# Altium schematic sheet LOGIC.SchDoc
size Letter; SheetNumber: 3; SheetTotal: 3
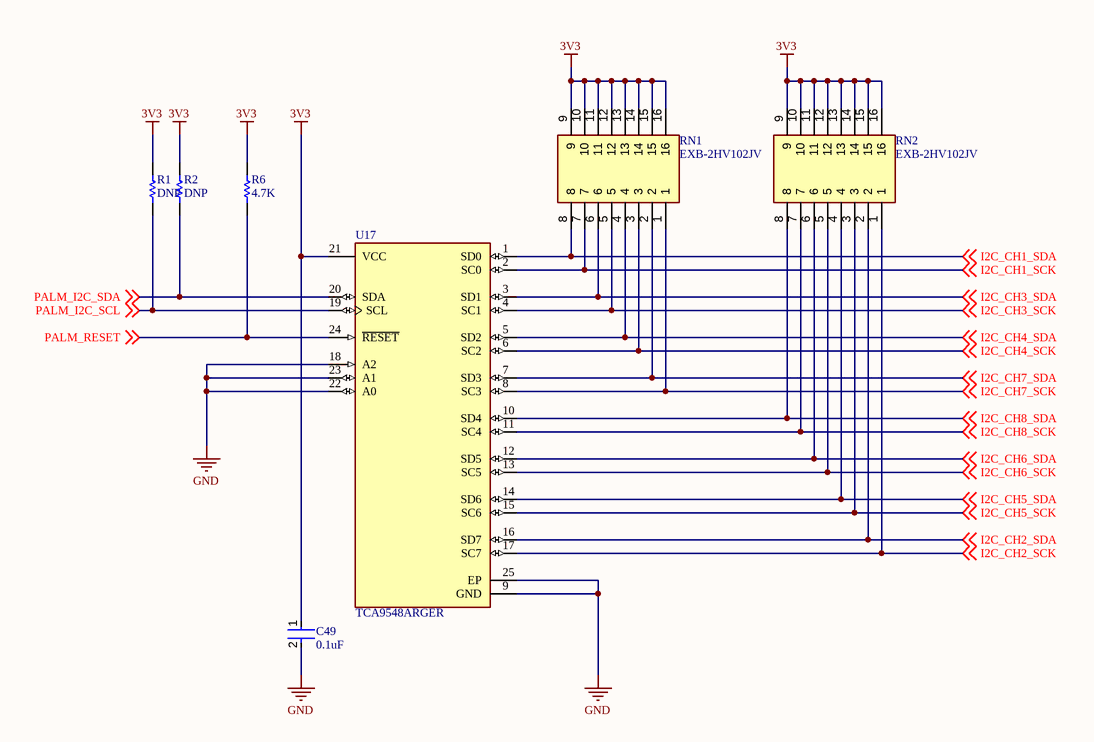
[diagram p0: LOGIC.SchDoc]

## Parts
C49  0.1uF  [FP-GRM15-MFG]
R1  DNP  [RESC1005X40X25LL05T10]
R2  DNP  [RESC1005X40X25LL05T10]
R6  4.7K  [RESC1005X40X25LL05T05]
RN1  EXB-2HV102JV  [EXB2HV102JV]
RN2  EXB-2HV102JV  [EXB2HV102JV]
U17  TCA9548ARGER  [FP-RGE0024C-MFG]

## Nets
3V3: C49.1 R1.2 R2.2 R6.2 RN1.9 RN1.10 RN1.11 RN1.12 RN1.13 RN1.14 RN1.15 RN1.16 RN2.9 RN2.10 RN2.11 RN2.12 RN2.13 RN2.14 RN2.15 RN2.16 U17.21(VCC)
GND: C49.2 U17.9(GND) U17.18(A2) U17.22(A0) U17.23(A1) U17.25(EP)
I2C_CH1_SCK: RN1.7 U17.2(SC0) ; off-sheet I2C_CH1_SCK
I2C_CH1_SDA: RN1.8 U17.1(SD0) ; off-sheet I2C_CH1_SDA
I2C_CH2_SCK: RN2.1 U17.17(SC7) ; off-sheet I2C_CH2_SCK
I2C_CH2_SDA: RN2.2 U17.16(SD7) ; off-sheet I2C_CH2_SDA
I2C_CH3_SCK: RN1.5 U17.4(SC1) ; off-sheet I2C_CH3_SCK
I2C_CH3_SDA: RN1.6 U17.3(SD1) ; off-sheet I2C_CH3_SDA
I2C_CH4_SCK: RN1.3 U17.6(SC2) ; off-sheet I2C_CH4_SCK
I2C_CH4_SDA: RN1.4 U17.5(SD2) ; off-sheet I2C_CH4_SDA
I2C_CH5_SCK: RN2.3 U17.15(SC6) ; off-sheet I2C_CH5_SCK
I2C_CH5_SDA: RN2.4 U17.14(SD6) ; off-sheet I2C_CH5_SDA
I2C_CH6_SCK: RN2.5 U17.13(SC5) ; off-sheet I2C_CH6_SCK
I2C_CH6_SDA: RN2.6 U17.12(SD5) ; off-sheet I2C_CH6_SDA
I2C_CH7_SCK: RN1.1 U17.8(SC3) ; off-sheet I2C_CH7_SCK
I2C_CH7_SDA: RN1.2 U17.7(SD3) ; off-sheet I2C_CH7_SDA
I2C_CH8_SCK: RN2.7 U17.11(SC4) ; off-sheet I2C_CH8_SCK
I2C_CH8_SDA: RN2.8 U17.10(SD4) ; off-sheet I2C_CH8_SDA
PALM_I2C_SCL: R1.1 U17.19(SCL) ; off-sheet PALM_I2C_SCL
PALM_I2C_SDA: R2.1 U17.20(SDA) ; off-sheet PALM_I2C_SDA
PALM_RESET: R6.1 U17.24(~{RESET}) ; off-sheet PALM_RESET

## Notes on the sheet
- Title
- Copyright (c) Meta Platforms, Inc. and affiliates.
  All rights reserved.
  This source code is licensed under the license found in the
  LICENSE file in the root directory of this source tree.
- Sheet
- of

## Library data of the parts
C49 = CMP-2100-03641-2: CAP CER 0.1UF 16V X7R 0402; Manufacturer Part Number: GRM155R71C104KA88D; Manufacturer: Murata; Standoff Height: 0mm; Tolerance: 10%; Voltage Rating: 16Vdc; Material: Ceramic; Capacitance: 0.10μF; Value: 0.10μF; RoHS: TRUE; Temperature Characteristic: X7R; Octopart: https://octopart.com/grm155r71c104ka88d-murata-196880; Digikey Description: CAP CER 0.1UF 16V X7R 0402; Device Class L3: Ceramic Capacitors; Height: 0.55mm; ComponentLink2Description: Datasheet; Temperature Range Low: -55°C; Ipc Land Pattern Name: CAPC10050X219; ComponentLink2URL: https://search.murata.co.jp/Ceramy/image/img/A01X/G101/ENG/GRM155R71H471KA01-01A.pdf; Device Class L1: Passive Components; Lead Free: yes; Category: Cap; Package: GRM15; Temperature: -55°C to +125°C; Device Class L2: Capacitors; Temperature Range High: +125°C; Mouser Description: 0402 0.1 uF 16V ±10 % Tolerance X7R SMT Multilayer Ceramic Capacitor
R1 R2 = CMP-2002-07941-1: Part Number: RC0402JR-071KL; Manufacturer: Yageo / Phycomp
R6 = CMP-2002-01154-4: Chip Resistor, 4.7 KOhm, +/- 1%, 0.1 W, -55 to 155 degC, 0402 (1005 Metric), RoHS, Tape and Reel; PartNumber: ERJ-2RKF4701X; Voltage Rating: 50 V; Case\/Package: 0402; Power Rating: 100 mW; Height: 0.35 mm; Mounting Technology: Surface Mount; REACH SVHC: Yes; Resistance: 4.7 KOhm; Max Operating Temperature: 155 degC; ComponentLink1Description: Manufacturer URL; ComponentLink2Description: Datasheet; Pins: 2; PackageReference: 0402; Tolerance: 1%; Case Code (Imperial): 0402; Length: 1 mm; PackageDescription: 2-Pin Surface Mount Device, Body 1 x 0.5 mm; RoHSCompliant: true; Package Quantity: 1; Radiation Hardening: No; DatasheetVersion: 04/2015; Width: 0.5 mm; Case Code (Metric): 1005; Mount: Surface Mount; ComponentLink1URL: http://www.panasonic.com/; Min Operating Temperature: -55 degC; Packaging: Cut Tape; ComponentLink2URL: http://industrial.panasonic.com/cdbs/www-data/pdf/RDA0000/AOA0000C86.pdf
RN1 RN2 = EXB-2HV102JV: Resistor Network; Manufacturer_Name: Panasonic; Datasheet Link: https://industrial.panasonic.com/cdbs/www-data/pdf/AOC0000/AOC0000C14.pdf; Height: 0.55mm; Manufacturer_Part_Number: EXB-2HV102JV; Mouser Part Number: 667-EXB-2HV102JV; Mouser Price/Stock: https://www.mouser.co.uk/ProductDetail/Panasonic/EXB-2HV102JV?qs=oE3VwAv%2FYtkhk%252Bvg87pJMg%3D%3D; Arrow Part Number: EXB-2HV102JV; Arrow Price/Stock: https://www.arrow.com/en/products/exb-2hv102jv/panasonic?region=nac
U17 = CMP-04892-000041-1: IC I2C SW 8CH W/RESET 24VQFN; Independent Circuits: 1; Supply Type: Single; Max Supply Voltage: 5.5V; On-State Resistance: 70R; Max Supply Current: 80uA; Min Supply Voltage: 1.65V; Propagation Delay: 1ns; Mount: Surface Mount; Case/Package: VQFN; Number of Pins: 24; REACH SVHC: No SVHC; RoHS Compliant: Yes; Lead Free: Lead Free; Radiation Hardening: No; Weight: 0.001926oz; Min Operating Temperature: -40°C; Package Quantity: 3000; Packaging: Tape and Reel; Max Operating Temperature: 85°C